# Altium schematic sheet Data_Interface.SchDoc: Optocouplers
size A3; Author: M.Beldyga; CompanyName: WUT ISE; DrawnBy: M.Beldyga; Organization: WUT ISE; Address1: PW ISE; Address2: Nowowiejska 15/19 00-665 Warsaw; Address3: micbeldyga@gmail.com; SheetNumber: 6; SheetTotal: 10; ModifiedBy: -; CheckedDate: -; DivGrp: WUT ISE; Designer: M.Beldyga; ModifiedDate: -; ProjectName: Sensor Box
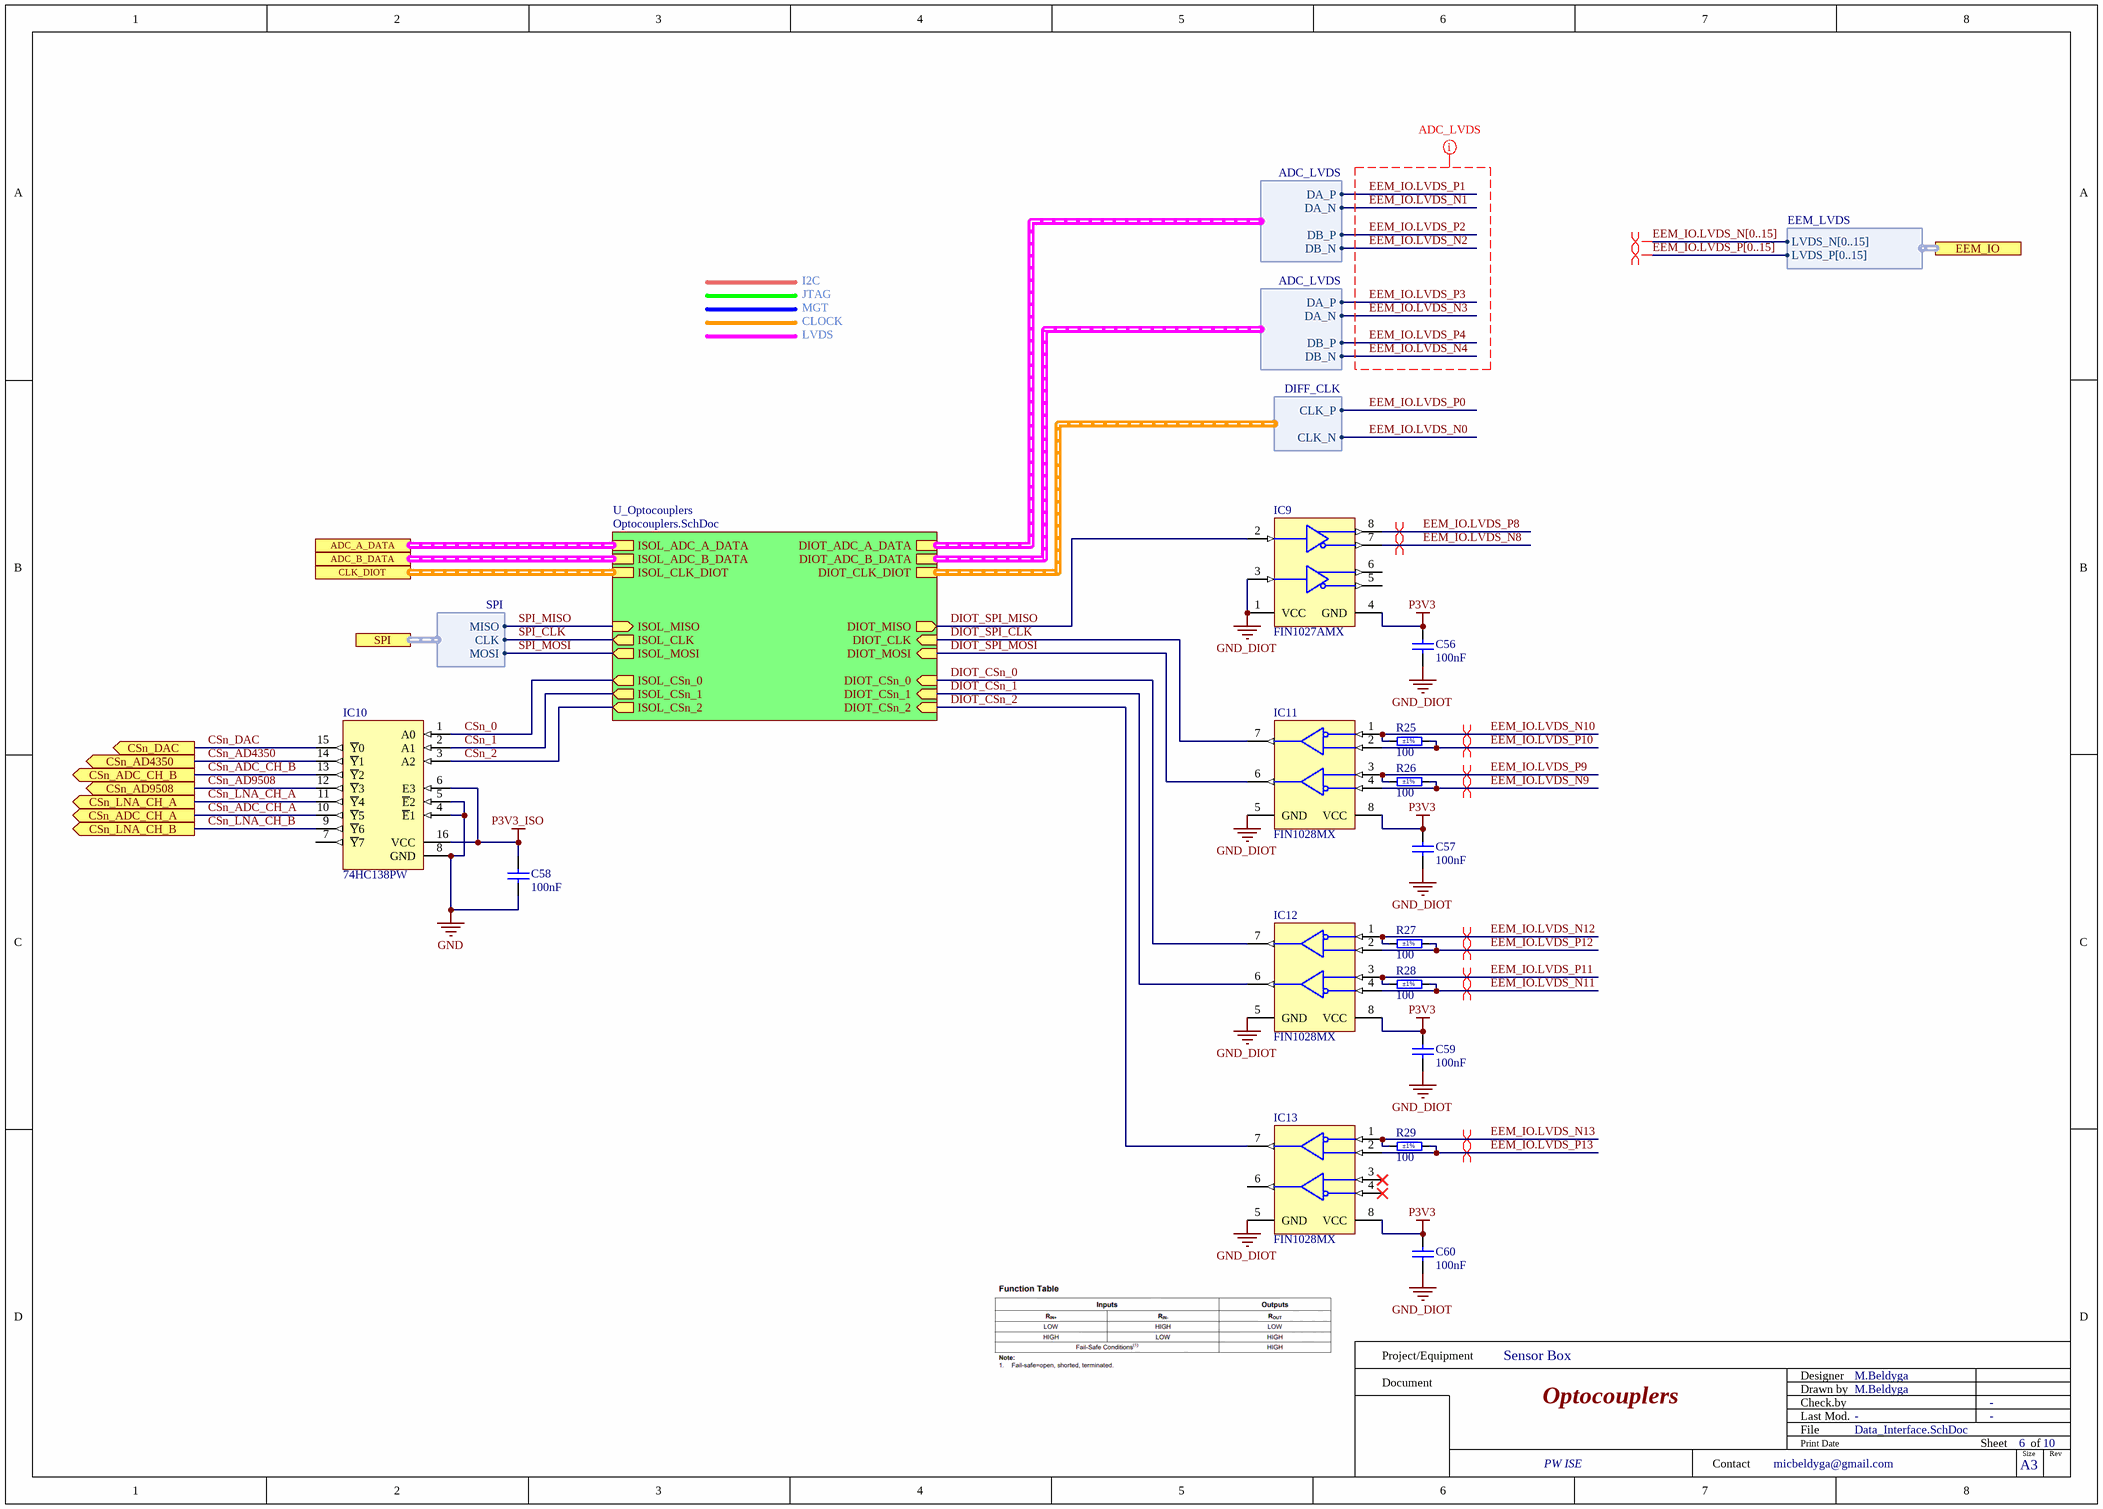
[diagram p0: Data_Interface.SchDoc]

## Parts
C56  100nF  [CAPC1005X55N]
C57  100nF  [CAPC1005X55N]
C58  100nF  [CAPC1005X55N]
C59  100nF  [CAPC1005X55N]
C60  100nF  [CAPC1005X55N]
IC9  FIN1027AMX  [SOIC127P600X175-8N]
IC10  74HC138PW  [SOP65P640X110-16N]
IC11  FIN1028MX  [SOIC127P600X175-8N]
IC12  FIN1028MX  [SOIC127P600X175-8N]
IC13  FIN1028MX  [SOIC127P600X175-8N]
R25  100  Tolerance: ±1%  [RESC1005X40N]
R26  100  Tolerance: ±1%  [RESC1005X40N]
R27  100  Tolerance: ±1%  [RESC1005X40N]
R28  100  Tolerance: ±1%  [RESC1005X40N]
R29  100  Tolerance: ±1%  [RESC1005X40N]

## Sub-sheets
U_Optocouplers = Optocouplers.SchDoc: DIOT_MOSI (in), DIOT_MISO (out), DIOT_CLK (in), DIOT_CSn_0 (in), DIOT_CSn_1 (in), DIOT_CSn_2 (in), ISOL_MOSI (out), ISOL_MISO (in), ISOL_CLK (out), ISOL_CSn_0 (out), ISOL_CSn_1 (out), ISOL_CSn_2 (out), ISOL_ADC_A_DATA (harness ADC_LVDS), ISOL_ADC_B_DATA (harness ADC_LVDS), ISOL_CLK_DIOT (harness DIFF_CLK), DIOT_ADC_A_DATA (harness ADC_LVDS), DIOT_ADC_B_DATA (harness ADC_LVDS), DIOT_CLK_DIOT (harness DIFF_CLK)

## Ports
ADC_A_DATA (harness ADC_LVDS), ADC_B_DATA (harness ADC_LVDS), CLK_DIOT (harness DIFF_CLK), CSn_AD4350 (out), CSn_AD9508 (out), CSn_ADC_CH_A (out), CSn_ADC_CH_B (out), CSn_DAC (out), CSn_LNA_CH_A (out), CSn_LNA_CH_B (out), EEM_IO (harness EEM_LVDS), SPI (harness SPI)

## Harnesses
SPI: CLK, MOSI, MISO
DIFF_CLK: CLK_P, CLK_N
ADC_LVDS: DA_P, DA_N, DB_P, DB_N
EEM_LVDS: LVDS_P[0..15], LVDS_N[0..15]

## Nets
GND: C58.1 IC10.4(~{E}1) IC10.5(~{E}2) IC10.8(GND)
GND_DIOT: C56.1 C57.1 C59.1 C60.1 IC9.1(VCC) IC9.3(DIN2RIN-) IC11.5(GND) IC12.5(GND) IC13.5(GND)
P3V3: C56.2 C57.2 C59.2 C60.2 IC9.4(GND) IC11.8(VCC) IC12.8(VCC) IC13.8(VCC)
P3V3_ISO: C58.2 IC10.6(E3) IC10.16(VCC)
CSn_0: IC10.1(A0) ; sheet U_Optocouplers/ISOL_CSn_0
CSn_1: IC10.2(A1) ; sheet U_Optocouplers/ISOL_CSn_1
CSn_2: IC10.3(A2) ; sheet U_Optocouplers/ISOL_CSn_2
CSn_AD4350: IC10.14(~{Y}1) ; port CSn_AD4350
CSn_AD9508: IC10.12(~{Y}3) ; port CSn_AD9508
CSn_ADC_CH_A: IC10.10(~{Y}5) ; port CSn_ADC_CH_A
CSn_ADC_CH_B: IC10.13(~{Y}2) ; port CSn_ADC_CH_B
CSn_DAC: IC10.15(~{Y}0) ; port CSn_DAC
CSn_LNA_CH_A: IC10.11(~{Y}4) ; port CSn_LNA_CH_A
CSn_LNA_CH_B: IC10.9(~{Y}6) ; port CSn_LNA_CH_B
DIOT_CSn_0: IC12.7(ROUT1) ; sheet U_Optocouplers/DIOT_CSn_0
DIOT_CSn_1: IC12.6(ROUT2) ; sheet U_Optocouplers/DIOT_CSn_1
DIOT_CSn_2: IC13.7(ROUT1) ; sheet U_Optocouplers/DIOT_CSn_2
DIOT_SPI_CLK: IC11.7(ROUT1) ; sheet U_Optocouplers/DIOT_CLK
DIOT_SPI_MISO: IC9.2(DIN1) ; sheet U_Optocouplers/DIOT_MISO
DIOT_SPI_MOSI: IC11.6(ROUT2) ; sheet U_Optocouplers/DIOT_MOSI
EEM_IO.LVDS_N0: sheet U_Optocouplers/DIOT_CLK_DIOT.CLK_N
EEM_IO.LVDS_N1: sheet U_Optocouplers/DIOT_ADC_A_DATA.DA_N
EEM_IO.LVDS_N2: sheet U_Optocouplers/DIOT_ADC_A_DATA.DB_N
EEM_IO.LVDS_N3: sheet U_Optocouplers/DIOT_ADC_B_DATA.DA_N
EEM_IO.LVDS_N4: sheet U_Optocouplers/DIOT_ADC_B_DATA.DB_N
EEM_IO.LVDS_N8: IC9.7(DOUT-)
EEM_IO.LVDS_N9: IC11.4(RIN2-) R26.1
EEM_IO.LVDS_N10: IC11.1(RIN1-) R25.2
EEM_IO.LVDS_N11: IC12.4(RIN2-) R28.1
EEM_IO.LVDS_N12: IC12.1(RIN1-) R27.2
EEM_IO.LVDS_N13: IC13.1(RIN1-) R29.2
EEM_IO.LVDS_P0: sheet U_Optocouplers/DIOT_CLK_DIOT.CLK_P
EEM_IO.LVDS_P1: sheet U_Optocouplers/DIOT_ADC_A_DATA.DA_P
EEM_IO.LVDS_P2: sheet U_Optocouplers/DIOT_ADC_A_DATA.DB_P
EEM_IO.LVDS_P3: sheet U_Optocouplers/DIOT_ADC_B_DATA.DA_P
EEM_IO.LVDS_P4: sheet U_Optocouplers/DIOT_ADC_B_DATA.DB_P
EEM_IO.LVDS_P8: IC9.8(DOUT+)
EEM_IO.LVDS_P9: IC11.3(RIN2+) R26.2
EEM_IO.LVDS_P10: IC11.2(RIN1+) R25.1
EEM_IO.LVDS_P11: IC12.3(RIN2+) R28.2
EEM_IO.LVDS_P12: IC12.2(RIN1+) R27.1
EEM_IO.LVDS_P13: IC13.2(RIN1+) R29.1
SPI_CLK: sheet U_Optocouplers/ISOL_CLK, port SPI.CLK
SPI_MISO: sheet U_Optocouplers/ISOL_MISO, port SPI.MISO
SPI_MOSI: sheet U_Optocouplers/ISOL_MOSI, port SPI.MOSI

Not connected (* = marked no-connect by the designer): IC9 5(DOUT-) 6(DOUT+); IC10 7(~{Y}7); IC13 3(RIN2+)* 4(RIN2-)* 6(ROUT2)

## Buses and harness runs
bus EEM_IO.LVDS_N[0..15]
bus EEM_IO.LVDS_P[0..15]
harness port ADC_A_DATA = sheet U_Optocouplers/ISOL_ADC_A_DATA
harness port ADC_B_DATA = sheet U_Optocouplers/ISOL_ADC_B_DATA
harness port CLK_DIOT = sheet U_Optocouplers/ISOL_CLK_DIOT

## Layout directives
differential pair; net class D100: (no net found under the mark), EEM_IO.LVDS_N8, EEM_IO.LVDS_N9, EEM_IO.LVDS_N10, EEM_IO.LVDS_N11, EEM_IO.LVDS_N12, EEM_IO.LVDS_N13, EEM_IO.LVDS_P8, EEM_IO.LVDS_P9, EEM_IO.LVDS_P10, EEM_IO.LVDS_P11, EEM_IO.LVDS_P12, EEM_IO.LVDS_P13
net class ADC_LVDS: EEM_IO.LVDS_N1, EEM_IO.LVDS_N2, EEM_IO.LVDS_N3, EEM_IO.LVDS_N4, EEM_IO.LVDS_P1, EEM_IO.LVDS_P2, EEM_IO.LVDS_P3, EEM_IO.LVDS_P4

## Notes on the sheet
- I2C
- JTAG
- MGT
- CLOCK
- LVDS
- Project/Equipment
- Document
- Designer
- Drawn by
- Check.by
- Contact
- File
- Last Mod.
- Print Date
- Sheet
- Size
- A3
- of
- Rev

## Library data of the parts
C56-C60 = CC0402_100NF_50V_10%_X7R: Non-polarised capacitor; Part Description: SMD Multilayer Chip Ceramic Capacitor; Manufacturer: GENERIC; Manufacturer1 Part Number: GRM155R71H104KE14D; Voltage: 50V; TC: X7R; Tolerance: ±10%; Part Number: CC0402_100NF_50V_10%_X7R; Component Kind: Standard; Component Type: Standard; Pin Count: 2; Value: 100nF; Status: None; Manufacturer Part Number: CC0402_100NF_50V_10%_X7R; Case: 0402; Mounted: Yes; Socket: No; SMD: Yes; Sense: No; Manufacturer1 Example: MURATA; Manufacturer1 ComponentHeight: 0.55mm; HelpURL: \\cern.ch\dfs\Applications\Altium\Datasheets\CC0402_MURATA_GRM155R71H104KE14D.pdf; Author: CERN DEM MR; CreateDate: 6/30/2017; LatestRevisionDate: 6/30/2017
IC9 = FIN1027A: 3.3V LVDS, 2-Bit, High-Speed, Differential Driver; Manufacturer: ON Semiconductor; PressFit: No; Bonding: No; Part Number: FIN1027AMX; Component Kind: Standard; Component Type: Standard; Device: FIN1027AMX; PackageDescription: SOIC 8, Pitch 1.27mm - Body 4x5mm, IPC Medium Density; Part Description: 3.3V LVDS, 2-Bit, High-Speed, Differential Driver; Manufacturer Part Number: FIN1027AMX; Pin Count: 8; Case: SOIC8; Mounted: Yes; Socket: No; SMD: Yes; Sense: No; ComponentHeight: 0.8mm; Author: GK; HelpURL: \\cern.ch\dfs\Applications\Altium\Datasheets\FIN1101K8X.pdf; CreateDate: 08/11/2016; LatestRevisionDate: 08/11/2016
IC10 = 74HC138PW: 3-Line to 8-Line Decoder/Demultiplexer; Part Description: 3-Line to 8-Line Decoder/Demultiplexer, Inverting; Manufacturer: NXP SEMICONDUCTORS; PressFit: No; Bonding: No; Part Number: 74HC138PW; Component Kind: Standard; Component Type: Standard; Device: 74HC138PW; PackageDescription: SOP, 0.65mm Pitch; 16 Pin, 4.40mm W X 5.00mm L X 1.10mm H body IPC Medium Density; Manufacturer Part Number: 74HC138PW; Pin Count: 16; Case: TSSOP16; Mounted: Yes; Socket: No; SMD: Yes; Sense: No; ComponentHeight: 1.1mm; Author: CERN DEM JLC; HelpURL: \\cern.ch\dfs\Applications\Altium\Datasheets\74HC138PW.pdf; CreateDate: 6/9/2015; LatestRevisionDate: 6/9/2015
IC11-IC13 = FIN1028: 3.3V LVDS 2-Bit High-Speed Differential Reciever; Manufacturer: ON Semiconductor; PressFit: No; Bonding: No; Part Number: FIN1028MX; Component Kind: Standard; Component Type: Standard; Device: FIN1028MX; PackageDescription: SOIC 8, Pitch 1.27mm - Body 4x5mm, IPC Medium Density; Part Description: 3.3V LVDS 2-Bit High-Speed Differential Reciever; Manufacturer Part Number: FIN1028MX; Pin Count: 8; Case: SOIC8; Mounted: Yes; Socket: No; SMD: Yes; Sense: No; ComponentHeight: 0.8mm; Author: GK; HelpURL: \\cern.ch\dfs\Applications\Altium\Datasheets\FIN1101K8X.pdf; CreateDate: 08/11/2016; LatestRevisionDate: 08/11/2016
R25-R29 = R0402_100R_1%_0.0625W_100PPM: Resistor - 1%; Part Description: General Purpose Thick Film Chip Resistor; Manufacturer: GENERIC; Manufacturer1 Part Number: 232270671001L; TC: ±100ppm/°C; PressFit: No; Part Number: R0402_100R_1%_0.0625W_100PPM; Component Kind: Standard; Component Type: Standard; Pin Count: 2; Value: 100; Status: Not Recommended; Power: 0.0625W; Manufacturer Part Number: R0402_100R_1%_0.0625W_100PPM; Case: 0402; Mounted: Yes; Sense: No; Socket: No; SMD: Yes; Manufacturer1 Example: YAGEO PHYCOMP; Manufacturer1 ComponentHeight: 0.4mm; HelpURL: \\cern.ch\dfs\Applications\Altium\Datasheets\R0402_Phycomp_RC0402.pdf; Author: CERN DEM JLC; CreateDate: 12/3/2007; LatestRevisionDate: 10/17/2012